# Altium project AWH6_V10.PrjPcb (part 2 of 2)

## Sheet Wi-Fi.SchDoc
size A3; SheetNumber: 4; SheetTotal: 10
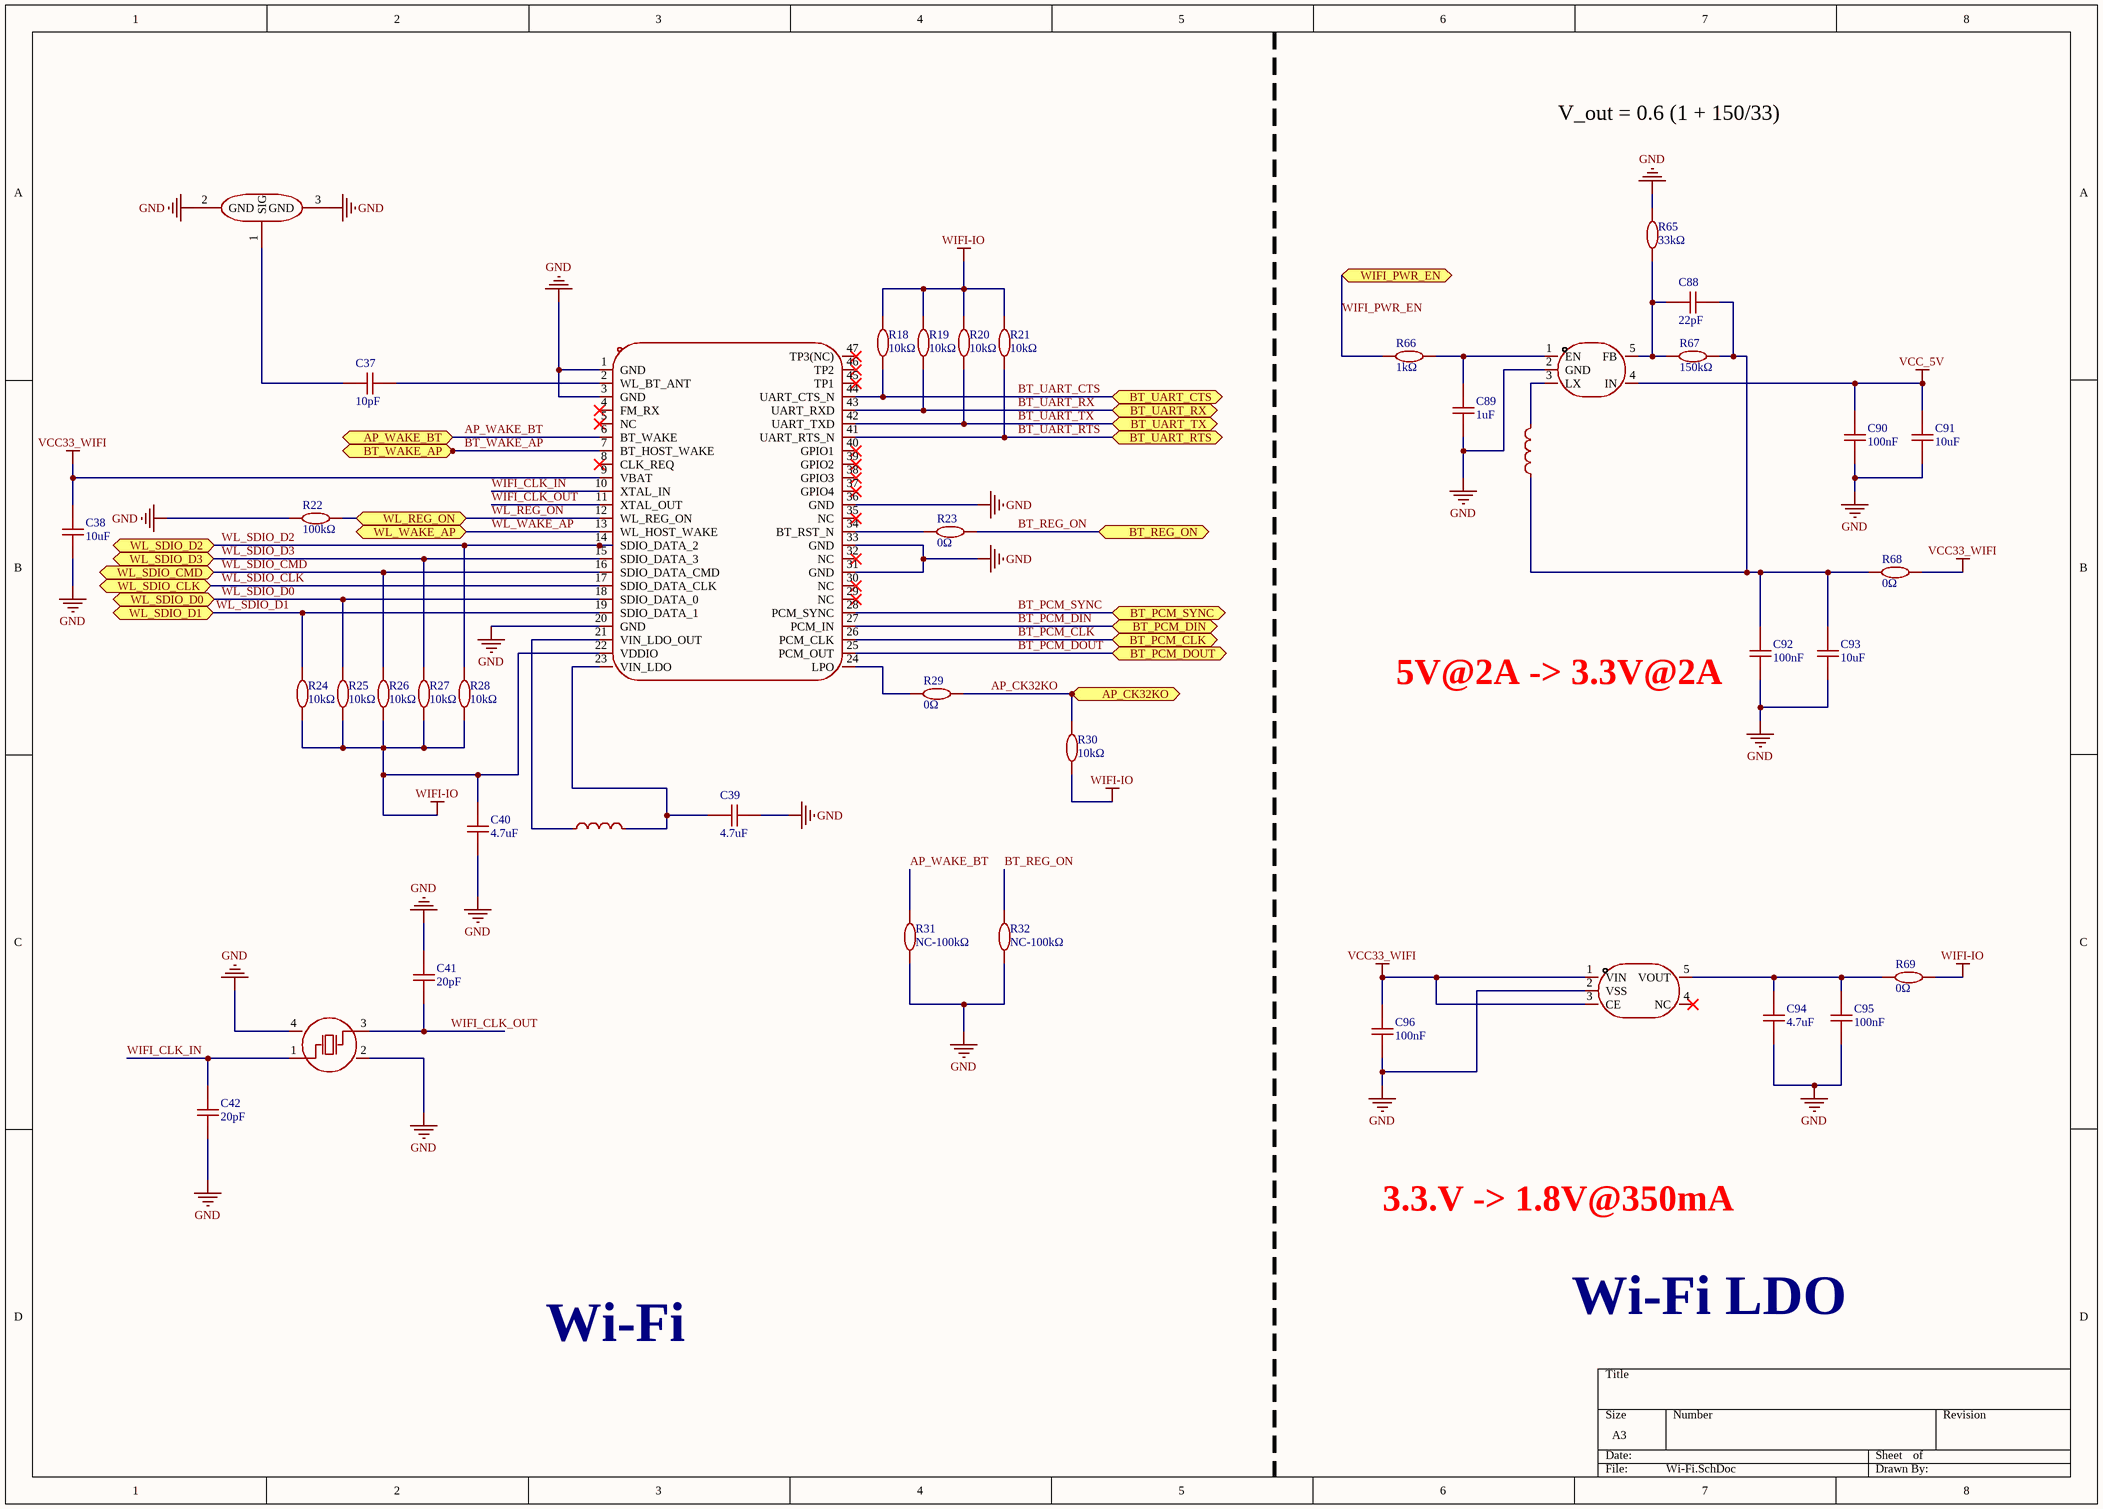
[diagram p5: Wi-Fi.SchDoc]

### Parts
C37  10pF  [C0402]
C38  10uF  [C0603]
C39  4.7uF  [C0402]
C40  4.7uF  [C0402]
C41  20pF  [C0402]
C42  20pF  [C0402]
C88  22pF  [C0402]
C89  1uF  [C0402]
C90  100nF  [C0402]
C91  10uF  [C0603]
C92  100nF  [C0402]
C93  10uF  [C0603]
C94  4.7uF  [C0402]
C95  100nF  [C0402]
C96  100nF  [C0402]
JP1  6GHz  [RF-SMD_FRF05002-JSS103M]  (value not drawn)
L1  4.7uH  [IND-SMD_L6.0-W6.0_FNR60XXS]  (value not drawn)
L7  4.7uH  [IND-SMD_L6.0-W6.0_FNR60XXS]  (value not drawn)
R18  10kΩ  [R0402]
R19  10kΩ  [R0402]
R20  10kΩ  [R0402]
R21  10kΩ  [R0402]
R22  100kΩ  [R0402]
R23  0Ω  [R0402]
R24  10kΩ  [R0402]
R25  10kΩ  [R0402]
R26  10kΩ  [R0402]
R27  10kΩ  [R0402]
R28  10kΩ  [R0402]
R29  0Ω  [R0402]
R30  10kΩ  [R0402]
R31  NC-100kΩ  [R0402]
R32  NC-100kΩ  [R0402]
R65  33kΩ  [R0402]
R66  1kΩ  [R0402]
R67  150kΩ  [R0402]
R68  0Ω  [R0402]
R69  0Ω  [R0402]
U6  2.4GHz  [QFN-44_L12.0-W12.0-P0.90-TL_AP6212]  (value not drawn)
U30  SY8089A1AAC  [TSOT-23-5_L2.9-W1.6-P0.95-LS2.8-BR]  (value not drawn)
U31  ME6212C18M5G  [SOT-23-5_L3.0-W1.7-P0.95-LS2.8-BL]  (value not drawn)
X1  26MHz  [CRYSTAL-SMD_4P-L3.2-W2.5-BL]  (value not drawn)

### Ports
AP_CK32KO (bidir, see SoC_2[4B]), AP_WAKE_BT (bidir, see SoC_1[6C]), BT_PCM_CLK (bidir, see SoC_1[6B]), BT_PCM_DIN (bidir, see SoC_1[6B]), BT_PCM_DOUT (bidir, see SoC_1[6B]), BT_PCM_SYNC (bidir, see SoC_1[6B]), BT_REG_ON (bidir, see SoC_1[6C]), BT_UART_CTS (bidir, see SoC_1[6B]), BT_UART_RTS (bidir, see SoC_1[6B]), BT_UART_RX (bidir, see SoC_1[6B]), BT_UART_TX (bidir, see SoC_1[6B]), BT_WAKE_AP (bidir, see SoC_1[6C]), WIFI_PWR_EN (bidir, see SoC_1[6B]), WL_REG_ON (bidir, see SoC_1[6C]), WL_SDIO_CLK (bidir, see SoC_1[7B]), WL_SDIO_CMD (bidir, see SoC_1[6B]), WL_SDIO_D0 (bidir, see SoC_1[6B]), WL_SDIO_D1 (bidir, see SoC_1[6B]), WL_SDIO_D2 (bidir, see SoC_1[6B]), WL_SDIO_D3 (bidir, see SoC_1[6B]), WL_WAKE_AP (bidir, see SoC_1[6C])

### Nets
GND: C38.1 C39.2 C40.1 C41.2 C42.1 C89.1 C90.1 C91.1 C92.1 C93.1 C94.1 C95.1 C96.1 JP1.2(GND) JP1.3(GND) R22.1 R31.1 R32.1 R65.2 U6.1(GND) U6.3(GND) U6.20(GND) U6.31(GND) U6.33(GND) U6.36(GND) U30.2(GND) U31.2(VSS) X1.2(GND) X1.4(GND)
VCC33_WIFI: C38.2 C96.2 R68.2 U6.9(VBAT) U31.1(VIN) U31.3(CE)
VCC_5V: C90.2 C91.2 U30.4(IN)  [project net PS]
WIFI-IO: C40.2 R18.2 R19.2 R20.2 R21.2 R24.1 R25.1 R26.1 R27.1 R28.1 R30.1 R69.2 U6.22(VDDIO)  [project net VCC_DCXOIO]
AP_CK32KO: R29.2 R30.2 ; port AP_CK32KO
AP_WAKE_BT: R31.2 U6.6(BT_WAKE) ; port AP_WAKE_BT
BT_PCM_CLK: U6.26(PCM_CLK) ; port BT_PCM_CLK
BT_PCM_DIN: U6.27(PCM_IN) ; port BT_PCM_DIN
BT_PCM_DOUT: U6.25(PCM_OUT) ; port BT_PCM_DOUT
BT_PCM_SYNC: U6.28(PCM_SYNC) ; port BT_PCM_SYNC
BT_REG_ON: R23.2 R32.2 ; port BT_REG_ON
BT_UART_CTS: R18.1 U6.44(UART_CTS_N) ; port BT_UART_CTS
BT_UART_RTS: R21.1 U6.41(UART_RTS_N) ; port BT_UART_RTS
BT_UART_RX: R19.1 U6.43(UART_RXD) ; port BT_UART_RX
BT_UART_TX: R20.1 U6.42(UART_TXD) ; port BT_UART_TX
BT_WAKE_AP: U6.7(BT_HOST_WAKE) ; port BT_WAKE_AP
WIFI_CLK_IN: C42.2 U6.10(XTAL_IN) X1.1(OSC1)
WIFI_CLK_OUT: C41.1 U6.11(XTAL_OUT) X1.3(OSC2)
WIFI_PWR_EN: R66.1 ; port WIFI_PWR_EN
WL_REG_ON: R22.2 U6.12(WL_REG_ON) ; port WL_REG_ON
WL_SDIO_CLK: U6.17(SDIO_DATA_CLK) ; port WL_SDIO_CLK
WL_SDIO_CMD: R26.2 U6.16(SDIO_DATA_CMD) ; port WL_SDIO_CMD
WL_SDIO_D0: R25.2 U6.18(SDIO_DATA_0) ; port WL_SDIO_D0
WL_SDIO_D1: R24.2 U6.19(SDIO_DATA_1) ; port WL_SDIO_D1
WL_SDIO_D2: R28.2 U6.14(SDIO_DATA_2) ; port WL_SDIO_D2
WL_SDIO_D3: R27.2 U6.15(SDIO_DATA_3) ; port WL_SDIO_D3
WL_WAKE_AP: U6.13(WL_HOST_WAKE) ; port WL_WAKE_AP
NetC37_1: C37.1 JP1.1(SIG)
NetC37_2: C37.2 U6.2(WL_BT_ANT)
NetC39_1: C39.1 L1.2 U6.23(VIN_LDO)
NetC88_1: C88.1 R65.1 R67.1 U30.5(FB)
NetC88_2: C88.2 C92.2 C93.2 L7.1 R67.2 R68.1
NetC89_2: C89.2 R66.2 U30.1(EN)
NetC94_2: C94.2 C95.2 R69.1 U31.5(VOUT)
NetL1_1: L1.1 U6.21(VIN_LDO_OUT)
NetL7_2: L7.2 U30.3(LX)
NetR23_1: R23.1 U6.34(BT_RST_N)
NetR29_1: R29.1 U6.24(LPO)

Not connected (* = marked no-connect by the designer): U6 4(FM_RX)* 5(NC)* 8(CLK_REQ)* 29(NC)* 30(NC)* 32(NC)* 35(NC)* 37(GPIO4)* 38(GPIO3)* 39(GPIO2)* 40(GPIO1)* 45(TP1)* 46(TP2)* 47(TP3(NC))*; U31 4(NC)*

### Notes on the sheet
- V_out = 0.6 (1 + 150/33)
- 5V@2A -> 3.3V@2A
- 3.3.V -> 1.8V@350mA
- Wi-Fi LDO
- Wi-Fi

### Library data of the parts
C37 = 10pF: 50V 10pF C0G ±5% 0402 Ceramic Capacitors ROHS
C38 C91 C93 = 10uF: 10V 10uF X5R ±10% 0603 Ceramic Capacitors ROHS
C39 C40 C94 = 4.7uF: 10V 4.7uF X5R ±20% 0402 Ceramic Capacitors ROHS
C41 C42 = 20pF: 50V 20pF NP0 ±5% 0402 Ceramic Capacitors ROHS
C88 = 22pF: 50V 22pF C0G ±5% 0402 Ceramic Capacitors ROHS
C89 = 1uF: 50V 1uF X5R ±10% 0402 Ceramic Capacitors ROHS
C90 C92 C95 C96 = 100nF: 50V 100nF X7R ±10% 0402 Ceramic Capacitors ROHS
JP1 = U.FL-R-SMT-1(80)_C88374: Manufacturer: HRS(广濑); Add into BOM: yes; Connector Type: Board Side; Interface: Male Pin; Number of Ports: 1; Interface Diameter: 2mm; Interface Length/Height: 1.25mm; RF Series: IPEX; Impedance: 50Ω; Symbol: U.FL-R-SMT-1(80); Device: U.FL-R-SMT-1(80)_C88374; LCSC Part Name: IPEX 内针; Supplier Part: C88374; Manufacturer Part: U.FL-R-SMT-1(80); Supplier Footprint: SMD; JLCPCB Part Class: Extended Part; Datasheet: https://item.szlcsc.com/datasheet/U.FL-R-SMT-1(80)/89553.html; Supplier: LCSC; Convert to PCB: yes; Value: 6GHz; Style: -; Operating Temperature Range: -40℃~+90℃
L1 L7 = FNR6020S4R7MT: 2.5A 4.7uH Magnetic Shielded Inductor ±20% 3.6A 75mΩ SMD,6x6mm Fixed Inductors ROHS; Manufacturer: cjiang(长江微电); Add into BOM: yes; Symbol: FNR6020S4R7MT; Device: FNR6020S4R7MT; LCSC Part Name: 4.7uH ±20% 3.6A; Supplier Part: C168008; Manufacturer Part: FNR6020S4R7MT; Supplier Footprint: SMD,6x6mm; JLCPCB Part Class: Extended Part; Datasheet: https://atta.szlcsc.com/upload/public/pdf/source/20190327/C167925_9EFF0AABC4CA629C2CC95961DBF7D39D.pdf; Supplier: LCSC; Convert to PCB: yes; Value: 4.7uH; Tolerance: ±20%; Saturation Current (Isat): 3.6A; DC Resistance (DCR): 75mΩ
R18-R21 R24-R28 R30 = 10kΩ: 62.5mW 10kΩ 50V ±100ppm/℃ Thick Film Resistor ±1% 0402 Chip Resistor - Surface Mount ROHS
R22 R31 R32 = 100kΩ: 100kΩ 62.5mW 50V ±100ppm/℃ Thick Film Resistor ±1% 0402 Chip Resistor - Surface Mount ROHS
R23 R29 R68 R69 = 0Ω: 0Ω 62.5mW 50V Thick Film Resistor ±1% 0402 Chip Resistor - Surface Mount ROHS
R65 = 33kΩ: 62.5mW 33kΩ 50V ±100ppm/℃ Thick Film Resistor ±1% 0402 Chip Resistor - Surface Mount ROHS
R66 = 1kΩ: 1kΩ 62.5mW 50V ±100ppm/℃ Thick Film Resistor ±1% 0402 Chip Resistor - Surface Mount ROHS
R67 = 150kΩ: 62.5mW 150kΩ 50V ±100ppm/℃ Thick Film Resistor ±1% 0402 Chip Resistor - Surface Mount ROHS
U6 = AP6212: 2.4GHz -90dBm QFN-44(12x12) RF Transceiver Modules and Modems ROHS; Manufacturer: AMPAK(正基科技); Add into BOM: yes; Interface Type: On-board PCB antenna; Output Power: 16dBm; Symbol: AP6212; Device: AP6212; LCSC Part Name: AP6212; Supplier Part: C2798300; Manufacturer Part: AP6212; Supplier Footprint: QFN-44(12x12); JLCPCB Part Class: Extended Part; Datasheet: https://item.szlcsc.com/datasheet/AP6212/2941698.html; Supplier: LCSC; Convert to PCB: yes; Utilized IC / Part: -; Wireless Standard: -; Value: 2.4GHz; Antenna Type: -; Voltage - Supply: -; Receive  Current: -; Send  Current: -; Sensitivity: -90dBm; Operating Temperature: -30℃~+85℃
U30 = SY8089A1AAC: 1.5MHz Buck 2A Adjustable 1 SOT-23-5 Voltage Regulators - DC DC Switching Regulators ROHS; Manufacturer: Silergy(矽力杰); Add into BOM: yes; Voltage - Supply: 2.5V~5.5V; Number of Outputs: 1; Quiescent Current: 50uA; Switch tube (built-in/external): Built-In; Symbol: SY8089A1AAC; Device: SY8089A1AAC; LCSC Part Name: 高效1.5MHz 2A同步降压调节器; Supplier Part: C479074; Manufacturer Part: SY8089A1AAC; Supplier Footprint: SOT-23-5; JLCPCB Part Class: Extended Part; Datasheet: https://item.szlcsc.com/datasheet/SY8089A1AAC/486366.html; Supplier: LCSC; Convert to PCB: yes; Function: Buck; Output Voltage: -; Output Current: 2A; Frequency - Switching: 1.5MHz; Operating Temperature: -40℃~+125℃@(TA/TJ); Synchronous Rectifier: Yes; Topology: Buck; Output Type: Adjustable
U31 = ME6212C18M5G: 65dB@(1kHz) Positive Fixed 1.8V SOT-23-5 Voltage Regulators - Linear, Low Drop Out (LDO) Regulators ROHS; Manufacturer: MICRONE(南京微盟); Add into BOM: yes; Voltage - Supply: 6V; Output Current: 350mA; Voltage Dropout: 200mV@(100mA); standby current: 50uA; Noise: 50uVrms; Number of Outputs: 1; Symbol: ME6212C18M5G; Device: ME6212C18M5G; LCSC Part Name: 输入6V 输出1.8V 250mA; Supplier Part: C236669; Manufacturer Part: ME6212C18M5G; Supplier Footprint: SOT-23-5; JLCPCB Part Class: Extended Part; Datasheet: https://item.szlcsc.com/datasheet/ME6212C18M5G/236109.html; Supplier: LCSC; Convert to PCB: yes; Output Type: Fixed; Output Voltage: 1.8V; Power Supply Rejection Ratio (PSRR): 65dB@(1kHz); Features: Enable; Operating Temperature: -40℃~+150℃@(Ta); Output Configuration: Positive
X1 = TAXM26M4RLBCCT2T: Crystal Oscillator 20pF SMD3225-4P Crystals ROHS; Manufacturer: YJX(雅晶鑫); Symbol: SMD-3225_4P26MHZ20PF10PPM-40~+85℃; Add into BOM: yes; Normal temperature Frequency Tolerance: ±10ppm; Frequency Stability: ±50ppm; Equivalent Series Resistance(ESR): 80Ω; Device: TAXM26M4RLBCCT2T; LCSC Part Name: 26MHz ±10ppm 20pF; Supplier Part: C164050; Manufacturer Part: TAXM26M4RLBCCT2T; Supplier Footprint: SMD3225-4P; JLCPCB Part Class: Extended Part; Datasheet: https://item.szlcsc.com/datasheet/TAXM26M4RLBCCT2T/175432.html; Supplier: LCSC; Convert to PCB: yes; Type: Crystal Oscillator; Value: 26MHz; Load Capacitance: 20pF; Operating Temperature: -40℃~+85℃

## Sheet SoC_2.SchDoc
size A3; SheetNumber: 6; SheetTotal: 10
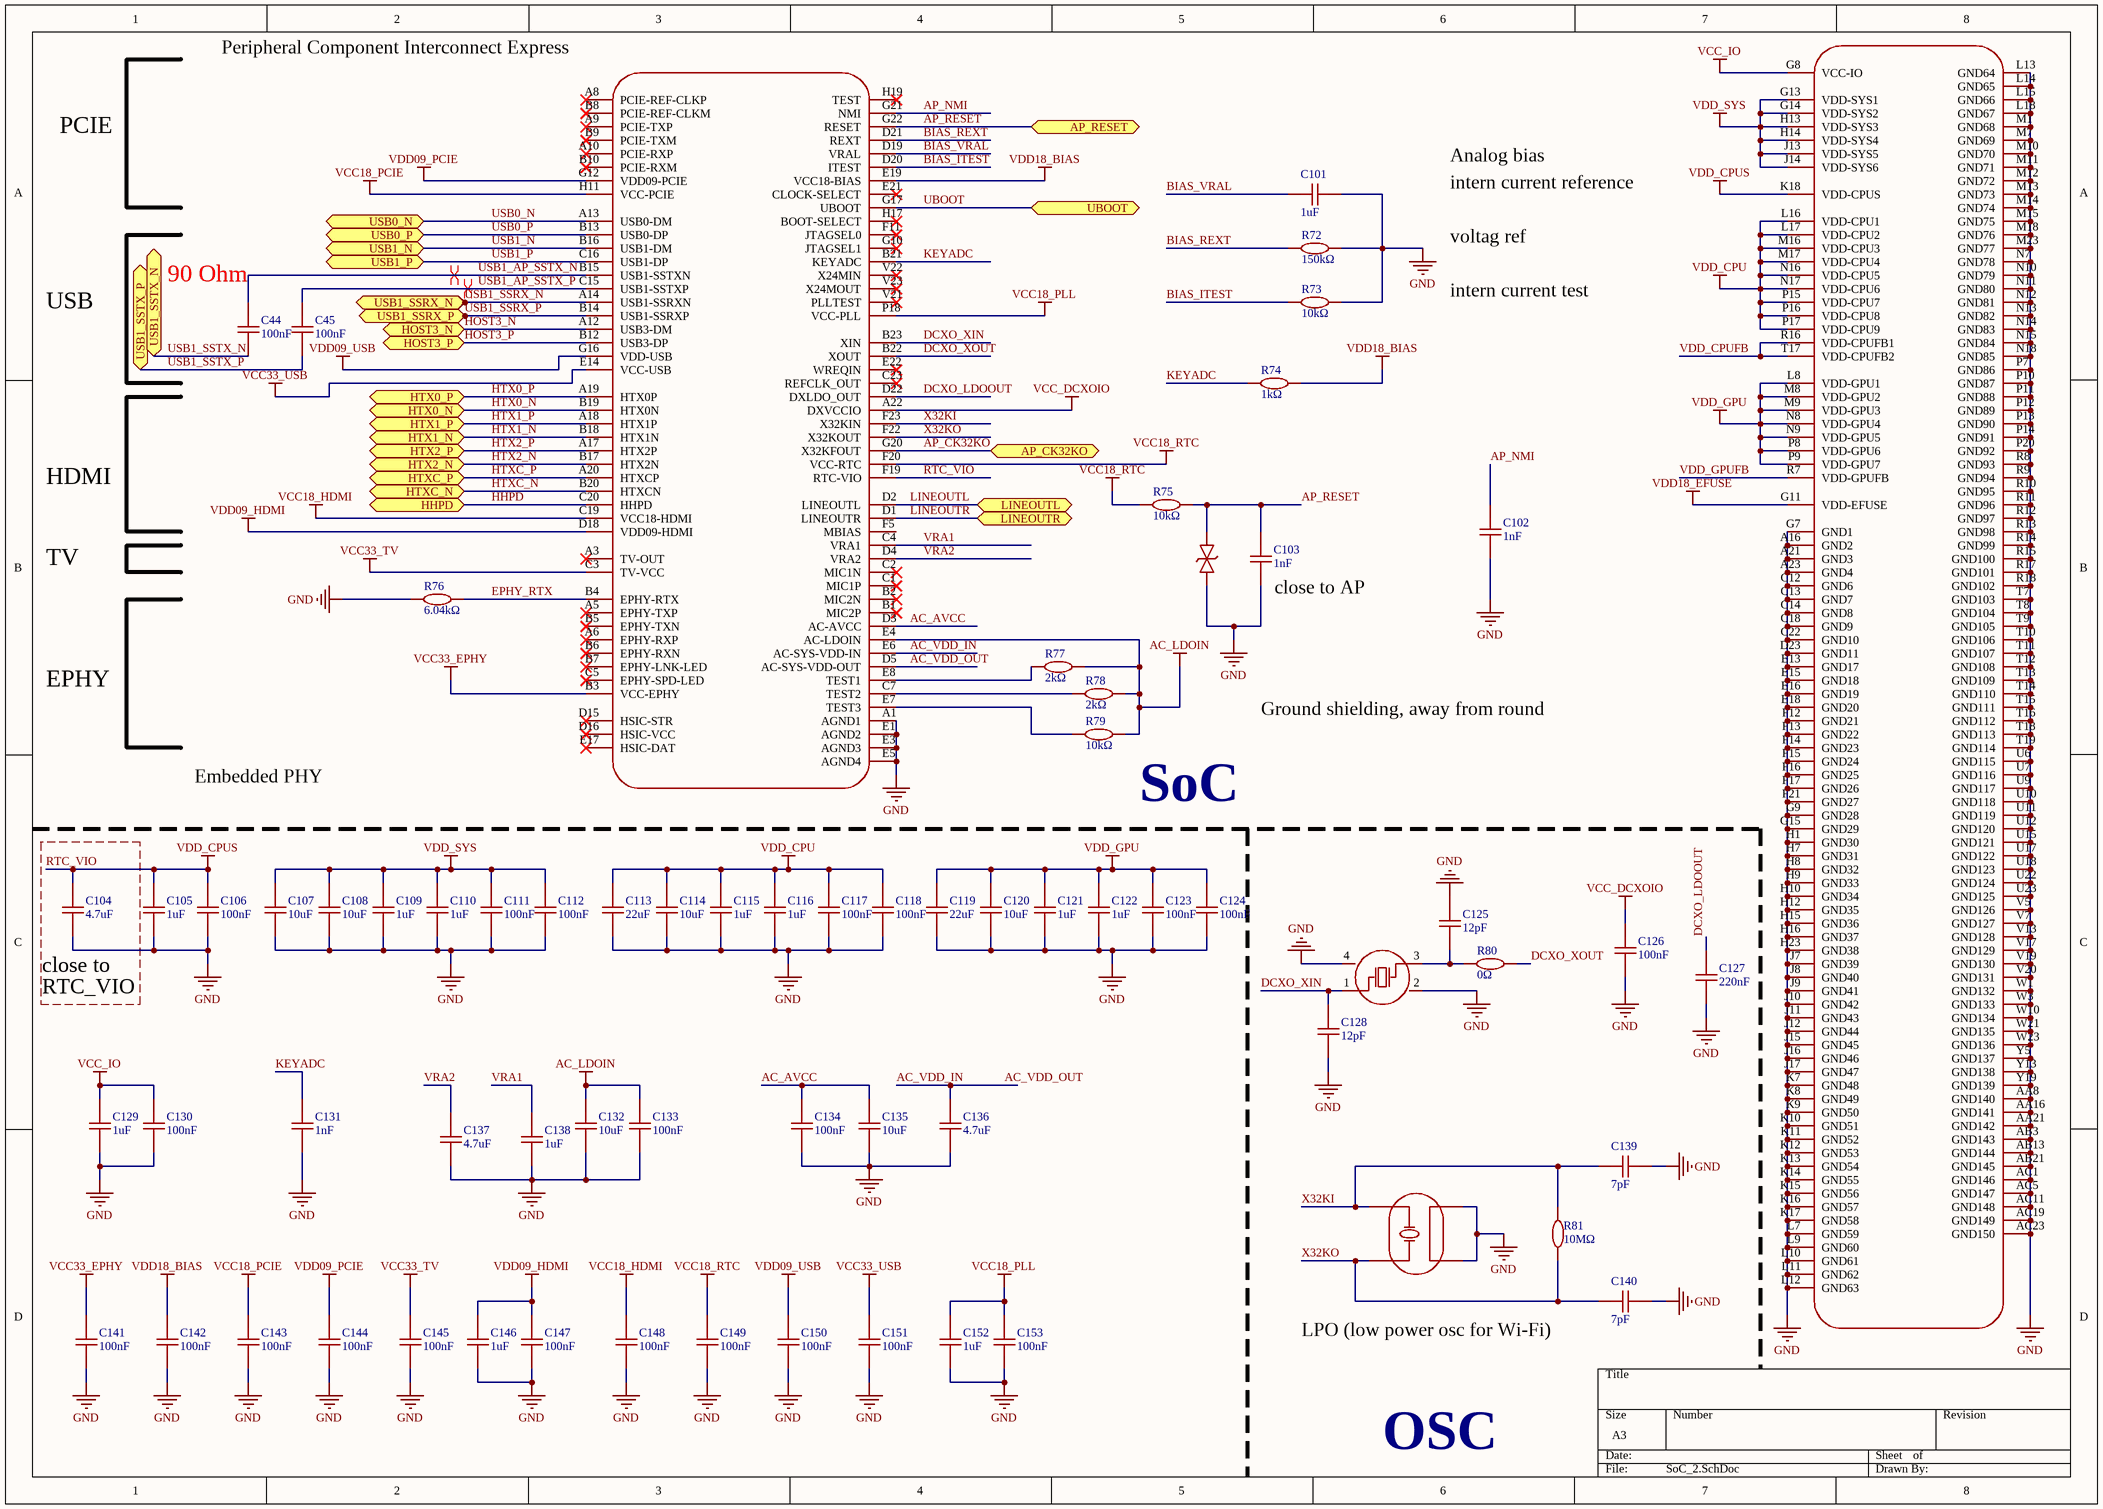
[diagram p6: SoC_2.SchDoc]

### Parts
C44  100nF  [C0402]
C45  100nF  [C0402]
C101  1uF  [C0402]
C102  1nF  [C0402]
C103  1nF  [C0402]
C104  4.7uF  [C0402]
C105  1uF  [C0402]
C106  100nF  [C0402]
C107  10uF  [C0603]
C108  10uF  [C0603]
C109  1uF  [C0402]
C110  1uF  [C0402]
C111  100nF  [C0402]
C112  100nF  [C0402]
C113  22uF  [C0603]
C114  10uF  [C0603]
C115  1uF  [C0402]
C116  1uF  [C0402]
C117  100nF  [C0402]
C118  100nF  [C0402]
C119  22uF  [C0603]
C120  10uF  [C0603]
C121  1uF  [C0402]
C122  1uF  [C0402]
C123  100nF  [C0402]
C124  100nF  [C0402]
C125  12pF  [C0402]
C126  100nF  [C0402]
C127  220nF  [C0402]
C128  12pF  [C0402]
C129  1uF  [C0402]
C130  100nF  [C0402]
C131  1nF  [C0402]
C132  10uF  [C0603]
C133  100nF  [C0402]
C134  100nF  [C0402]
C135  10uF  [C0603]
C136  4.7uF  [C0402]
C137  4.7uF  [C0402]
C138  1uF  [C0402]
C139  7pF  [C0402]
C140  7pF  [C0402]
C141  100nF  [C0402]
C142  100nF  [C0402]
C143  100nF  [C0402]
C144  100nF  [C0402]
C145  100nF  [C0402]
C146  1uF  [C0402]
C147  100nF  [C0402]
C148  100nF  [C0402]
C149  100nF  [C0402]
C150  100nF  [C0402]
C151  100nF  [C0402]
C152  1uF  [C0402]
C153  100nF  [C0402]
R72  150kΩ  [R0402]
R73  10kΩ  [R0402]
R74  1kΩ  [R0402]
R75  10kΩ  [R0402]
R76  6.04kΩ  [R0402]
R77  2kΩ  [R0402]
R78  2kΩ  [R0402]
R79  10kΩ  [R0402]
R80  0Ω  [R0402]
R81  10MΩ  [R0402]
U2  Allwinner_H6  [BGA451_ALLWINNER_H6]  (value not drawn)  (parts C,D of 4)
U32  ESD5451N  [DFN1006-2L-BI]  (value not drawn)
X2  24MHz  [CRYSTAL-SMD_4P-L3.2-W2.5-BL]  (value not drawn)
X3  32.768kHz  [MC-146_4P-L6.7-W1.5-P0.85-TL]  (value not drawn)

### Ports
AP_CK32KO (bidir, see Wi-Fi[5B]), AP_RESET (bidir, see GPIO[6C], Power[4B]), HHPD (bidir, see Audio-HDMI[4C]), HOST3_N (bidir, see TF-USB[3C]), HOST3_P (bidir, see TF-USB[3C]), HTX0_N (bidir, see Audio-HDMI[4C]), HTX0_P (bidir, see Audio-HDMI[4C]), HTX1_N (bidir, see Audio-HDMI[4C]), HTX1_P (bidir, see Audio-HDMI[4B]), HTX2_N (bidir, see Audio-HDMI[4B]), HTX2_P (bidir, see Audio-HDMI[4B]), HTXC_N (bidir, see Audio-HDMI[4C]), HTXC_P (bidir, see Audio-HDMI[4C]), LINEOUTL (bidir, see Audio-HDMI[6A]), LINEOUTR (bidir, see Audio-HDMI[6A]), UBOOT (bidir, see GPIO[6C]), USB0_N (bidir, see TF-USB[8A]), USB0_P (bidir, see TF-USB[8A]), USB1_N (bidir, see TF-USB[5C]), USB1_P (bidir, see TF-USB[5C]), USB1_SSRX_N (bidir, see SoC_2[2A], TF-USB[6C]), USB1_SSRX_P (bidir, see TF-USB[6C]), USB1_SSTX_N (bidir, see TF-USB[6C]), USB1_SSTX_P (bidir, see TF-USB[6C])

### Nets
AC_LDOIN: C132.2 C133.2 C141.2 C145.2 R77.2 R78.2 R79.1 U2.B3(VCC-EPHY) U2.C3(TV-VCC) U2.E4(AC-LDOIN)  [also labelled VCC33_EPHY, VCC33_TV]  [project net ALDO2]
GND: C101.2 C102.1 C103.1 C104.1 C105.1 C106.1 C107.1 C108.1 C109.1 C110.1 C111.1 C112.1 C113.1 C114.1 C115.1 C116.1 C117.1 C118.1 C119.1 C120.1 C121.1 C122.1 C123.1 C124.1 C125.2 C126.1 C127.1 C128.1 C129.1 C130.1 C131.1 C132.1 C133.1 C134.1 C135.1 C136.1 C137.1 C138.1 C139.2 C140.2 C141.1 C142.1 C143.1 C144.1 C145.1 C146.1 C147.1 C148.1 C149.1 C150.1 C151.1 C152.1 C153.1 R72.2 R73.2 R76.1 U2.A1(AGND1) U2.A16(GND2) U2.A21(GND3) U2.A23(GND4) U2.AA8(GND140) U2.AA16(GND141) U2.AA21(GND142) U2.AB3(GND143) U2.AB13(GND144) U2.AB21(GND145) U2.AC1(GND146) U2.AC5(GND147) U2.AC11(GND148) U2.AC19(GND149) U2.AC23(GND150) U2.C12(GND6) U2.C13(GND7) U2.C14(GND8) U2.C18(GND9) U2.C22(GND10) U2.D23(GND11) U2.E1(AGND2) U2.E3(AGND3) U2.E5(AGND4) U2.E13(GND17) U2.E15(GND18) U2.E16(GND19) U2.E18(GND20) U2.F12(GND21) U2.F13(GND22) U2.F14(GND23) U2.F15(GND24) U2.F16(GND25) U2.F17(GND26) U2.F21(GND27) U2.G7(GND1) U2.G9(GND28) U2.G15(GND29) U2.H1(GND30) U2.H7(GND31) U2.H8(GND32) U2.H9(GND33) U2.H10(GND34) U2.H12(GND35) U2.H15(GND36) U2.H16(GND37) U2.H23(GND38) U2.J7(GND39) U2.J8(GND40) U2.J9(GND41) U2.J10(GND42) U2.J11(GND43) U2.J12(GND44) U2.J15(GND45) U2.J16(GND46) U2.J17(GND47) U2.K7(GND48) U2.K8(GND49) U2.K9(GND50) U2.K10(GND51) U2.K11(GND52) U2.K12(GND53) U2.K13(GND54) U2.K14(GND55) U2.K15(GND56) U2.K16(GND57) U2.K17(GND58) U2.L7(GND59) U2.L9(GND60) U2.L10(GND61) U2.L11(GND62) U2.L12(GND63) U2.L13(GND64) U2.L14(GND65) U2.L15(GND66) U2.L18(GND67) U2.M1(GND68) U2.M7(GND69) U2.M10(GND70) U2.M11(GND71) U2.M12(GND72) U2.M13(GND73) U2.M14(GND74) U2.M15(GND75) U2.M18(GND76) U2.M23(GND77) U2.N7(GND78) U2.N10(GND79) U2.N11(GND80) U2.N12(GND81) U2.N13(GND82) U2.N14(GND83) U2.N15(GND84) U2.N18(GND85) U2.P7(GND86) U2.P10(GND87) U2.P11(GND88) U2.P12(GND89) U2.P13(GND90) U2.P14(GND91) U2.P20(GND92) U2.R8(GND93) U2.R9(GND94) U2.R10(GND95) U2.R11(GND96) U2.R12(GND97) U2.R13(GND98) U2.R14(GND99) U2.R15(GND100) U2.R17(GND101) U2.R18(GND102) U2.T7(GND103) U2.T8(GND104) U2.T9(GND105) U2.T10(GND106) U2.T11(GND107) U2.T12(GND108) U2.T13(GND109) U2.T14(GND110) U2.T15(GND111) U2.T16(GND112) U2.T18(GND113) U2.T19(GND114) U2.U6(GND115) U2.U7(GND116) U2.U9(GND117) U2.U10(GND118) U2.U11(GND119) U2.U12(GND120) U2.U15(GND121) U2.U17(GND122) U2.U18(GND123) U2.U22(GND124) U2.U23(GND125) U2.V5(GND126) U2.V7(GND127) U2.V13(GND128) U2.V17(GND129) U2.V19(GND130) U2.V20(GND131) U2.W1(GND132) U2.W3(GND133) U2.W10(GND134) U2.W21(GND135) U2.W23(GND136) U2.Y5(GND137) U2.Y13(GND138) U2.Y19(GND139) U32.1 X2.2(GND) X2.4(GND) X3.2 X3.3
RTC_VIO: C104.2 C105.2 C106.2 U2.F19(RTC-VIO) U2.K18(VDD-CPUS)  [also labelled VDD_CPUS]
VCC18_HDMI: C143.2 C148.2 U2.C19(VCC18-HDMI) U2.G11(VDD-EFUSE) U2.H11(VCC-PCIE)  [also labelled VCC18_PCIE, VDD18_EFUSE]  [project net BLDO2]
VCC18_PLL: C142.2 C152.2 C153.2 R74.2 U2.E19(VCC18-BIAS) U2.P18(VCC-PLL)  [also labelled VDD18_BIAS]  [project net BLDO1]
VCC18_RTC: C149.2 R75.1 U2.F20(VCC-RTC)
VCC33_USB: C129.2 C130.2 C151.2 U2.E14(VCC-USB) U2.G8(VCC-IO)  [also labelled VCC_IO]  [project net ALDO3]
VCC_DCXOIO: C126.2 U2.A22(DXVCCIO)
VDD09_HDMI: C107.2 C108.2 C109.2 C110.2 C111.2 C112.2 C144.2 C146.2 C147.2 C150.2 U2.D18(VDD09-HDMI) U2.G12(VDD09-PCIE) U2.G13(VDD-SYS1) U2.G14(VDD-SYS2) U2.G16(VDD-USB) U2.H13(VDD-SYS3) U2.H14(VDD-SYS4) U2.J13(VDD-SYS5) U2.J14(VDD-SYS6)  [also labelled VDD09_PCIE, VDD09_USB, VDD_SYS]
VDD_CPU: C113.2 C114.2 C115.2 C116.2 C117.2 C118.2 U2.L16(VDD-CPU1) U2.L17(VDD-CPU2) U2.M16(VDD-CPU3) U2.M17(VDD-CPU4) U2.N16(VDD-CPU5) U2.N17(VDD-CPU6) U2.P15(VDD-CPU7) U2.P16(VDD-CPU8) U2.P17(VDD-CPU9)
VDD_GPU: C119.2 C120.2 C121.2 C122.2 C123.2 C124.2 U2.L8(VDD-GPU1) U2.M8(VDD-GPU2) U2.M9(VDD-GPU3) U2.N8(VDD-GPU4) U2.N9(VDD-GPU5) U2.P8(VDD-GPU6) U2.P9(VDD-GPU7)
AC_AVCC: C134.2 C135.2 U2.D3(AC-AVCC)
AC_VDD_IN: C136.2 U2.D5(AC-SYS-VDD-OUT) U2.E6(AC-SYS-VDD-IN)  [also labelled AC_VDD_OUT]
AP_CK32KO: U2.G20(X32KFOUT) ; port AP_CK32KO
AP_NMI: C102.2 U2.G21(NMI)
AP_RESET: C103.2 R75.2 U2.G22(RESET) U32.2 ; port AP_RESET
BIAS_ITEST: R73.1 U2.D20(ITEST)
BIAS_REXT: R72.1 U2.D21(REXT)
BIAS_VRAL: C101.1 U2.D19(VRAL)
DCXO_LDOOUT: C127.2 U2.D22(DXLDO_OUT)
DCXO_XIN: C128.2 U2.B23(XIN) X2.1(OSC1)
DCXO_XOUT: R80.2 U2.B22(XOUT)
EPHY_RTX: R76.2 U2.B4(EPHY-RTX)
HHPD: U2.C20(HHPD) ; port HHPD
HOST3_N: U2.A12(USB3-DM) ; port HOST3_N
HOST3_P: U2.B12(USB3-DP) ; port HOST3_P
HTX0_N: U2.B19(HTX0N) ; port HTX0_N
HTX0_P: U2.A19(HTX0P) ; port HTX0_P
HTX1_N: U2.B18(HTX1N) ; port HTX1_N
HTX1_P: U2.A18(HTX1P) ; port HTX1_P
HTX2_N: U2.B17(HTX2N) ; port HTX2_N
HTX2_P: U2.A17(HTX2P) ; port HTX2_P
HTXC_N: U2.B20(HTXCN) ; port HTXC_N
HTXC_P: U2.A20(HTXCP) ; port HTXC_P
KEYADC: C131.2 R74.1 U2.B21(KEYADC)
LINEOUTL: U2.D2(LINEOUTL) ; port LINEOUTL
LINEOUTR: U2.D1(LINEOUTR) ; port LINEOUTR
UBOOT: U2.G17(UBOOT) ; port UBOOT
USB0_N: U2.A13(USB0-DM) ; port USB0_N
USB0_P: U2.B13(USB0-DP) ; port USB0_P
USB1_AP_SSTX_N: C44.2 U2.B15(USB1-SSTXN)
USB1_AP_SSTX_P: C45.2 U2.C15(USB1-SSTXP)
USB1_N: U2.B16(USB1-DM) ; port USB1_N
USB1_P: U2.C16(USB1-DP) ; port USB1_P
USB1_SSRX_N: U2.A14(USB1-SSRXN) ; port USB1_SSRX_N
USB1_SSRX_P: U2.B14(USB1-SSRXP) ; port USB1_SSRX_P
USB1_SSTX_N: C44.1 ; port USB1_SSTX_N
USB1_SSTX_P: C45.1 ; port USB1_SSTX_P
VDD_CPUFB: U2.R16(VDD-CPUFB1) U2.T17(VDD-CPUFB2)
VDD_GPUFB: U2.R7(VDD-GPUFB)
VRA1: C138.2 U2.C4(VRA1)
VRA2: C137.2 U2.D4(VRA2)
X32KI: C139.1 R81.2 U2.F23(X32KIN) X3.4(OSC2)
X32KO: C140.1 R81.1 U2.F22(X32KOUT) X3.1(OSC1)
NetC125_1: C125.1 R80.1 X2.3(OSC2)
NetR77_1: R77.1 U2.E8(TEST1)
NetR78_1: R78.1 U2.C7(TEST2)
NetR79_2: R79.2 U2.E7(TEST3)

Not connected (* = marked no-connect by the designer): U2 A3(TV-OUT)* A5(EPHY-TXP)* A6(EPHY-RXP)* A8(PCIE-REF-CLKP)* A9(PCIE-TXP)* A10(PCIE-RXP)* B1(MIC2P)* B2(MIC2N)* B5(EPHY-TXN)* B6(EPHY-RXN)* B7(EPHY-LNK-LED)* B8(PCIE-REF-CLKM)* B9(PCIE-TXM)* B10(PCIE-RXM)* C1(MIC1P)* C2(MIC1N)* C5(EPHY-SPD-LED)* C23(REFCLK_OUT)* D15(HSIC-STR)* D16(HSIC-VCC)* E17(HSIC-DAT)* E21(CLOCK-SELECT)* E22(WREQIN)* F5(MBIAS) F11(JTAGSEL0)* G10(JTAGSEL1)* H17(BOOT-SELECT)* H19(TEST)* V21(PLLTEST)* V22(X24MIN)* V23(X24MOUT)*

### Layout directives
differential pair: USB1_AP_SSTX_N, USB1_AP_SSTX_P

### Notes on the sheet
- (near U2) Peripheral Component Interconnect Express
- PCIE
- Analog bias
- intern current reference
- voltag ref
- USB
- (near C44) 90 Ohm
- intern current test
- HDMI
- TV
- (near C103) close to AP
- EPHY
- Ground shielding, away from round
- Embedded PHY
- (near R79) SoC
- close to
- RTC_VIO
- (near C140) LPO (low power osc for Wi-Fi)
- OSC

### Library data of the parts
C44 C45 C106 C111 C112 C117 C118 C123 C124 C126 C130 C133 C134 C141-C145 C147-C151 C153 = 100nF: as C90 on sheet Wi-Fi
C101 C105 C109 C110 C115 C116 C121 C122 C129 C138 C146 C152 = 1uF: as C89 on sheet Wi-Fi
C102 C103 C131 = 1nF: 50V 1nF X7R ±10% 0402 Ceramic Capacitors ROHS
C104 C136 C137 = 4.7uF: as C39 on sheet Wi-Fi
C107 C108 C114 C120 C132 C135 = 10uF: as C38 on sheet Wi-Fi
C113 C119 = 22uF: 16V 22uF X5R ±20% 0603 Ceramic Capacitors ROHS
C125 C128 = 12pF: 50V 12pF C0G ±5% 0402 Ceramic Capacitors ROHS
C127 = 220nF: 16V 220nF X7R ±10% 0402 Ceramic Capacitors ROHS
C139 C140 = 7pF: 50V 7pF NP0 0402 Ceramic Capacitors ROHS
R72 = 150kΩ: as R67 on sheet Wi-Fi
R73 R75 R79 = 10kΩ: as R18-R21 on sheet Wi-Fi
R74 = 1kΩ: as R66 on sheet Wi-Fi
R76 = 6.04kΩ: 6.04kΩ 62.5mW 50V ±100ppm/℃ Thick Film Resistor ±1% 0402 Chip Resistor - Surface Mount ROHS
R77 R78 = 2kΩ: 100mW 2kΩ 75V ±100ppm/℃ Thick Film Resistor ±1% 0402 Chip Resistor - Surface Mount ROHS
R80 = 0Ω: as R23 on sheet Wi-Fi
R81 = 10MΩ: 62.5mW 10MΩ 50V ±100ppm/℃ Thick Film Resistor ±1% 0402 Chip Resistor - Surface Mount ROHS
U2 = Allwinner_H6: Add into BOM: yes; Symbol: Allwinner_H6; Device: Allwinner_H6; Convert to PCB: yes
U32 = ESD5451N_C5261080: 9A 9.8V 8V Bidirectional 5V DFN1006-2L TVS Diodes ROHS; Manufacturer: HXY MOSFET(华轩阳电子); Add into BOM: yes; Reverse Leakage Current (Ir): 500nA; Number of Channels: 1.0; level of protection: IEC 61000-4-2; Junction Capacitance: 15pF; Symbol: ESD5451N_C5261080; Device: ESD5451N_C5261080; LCSC Part Name: 5V 15pF 双向; Supplier Part: C5261080; Manufacturer Part: ESD5451N; Supplier Footprint: DFN1006-2L; JLCPCB Part Class: Extended Part; Datasheet: https://item.szlcsc.com/datasheet/ESD5451N/5983779.html; Supplier: LCSC; Convert to PCB: yes; Polarity: Bidirectional; Reverse Stand-Off Voltage (Vrwm): 5V; Clamping Voltage: 9.8V; Peak Pulse Current (Ipp): 9A; Voltage - Breakdown: 8V; Type: ESD
X2 = X322524MOB4SI: Crystal Oscillator 12pF SMD3225-4P Crystals ROHS; Manufacturer: YXC(扬兴晶振); Add into BOM: yes; Normal temperature Frequency Tolerance: ±10ppm; Frequency Stability: ±20ppm; Symbol: X322524MOB4SI; Device: X322524MOB4SI; LCSC Part Name: YSX321SL 24MHZ 4P 3225 12PF ±10PPM -40~85℃ (±20PPM); Supplier Part: C70590; Manufacturer Part: X322524MOB4SI; Supplier Footprint: SMD3225-4P; JLCPCB Part Class: Extended Part; Datasheet: https://item.szlcsc.com/datasheet/X322524MOB4SI/71688.html; Supplier: LCSC; Convert to PCB: yes; Type: Surface Mount Crystal; Value: 24MHz; Load Capacitance: 12pF; Operating Temperature: -40℃~+85℃
X3 = Q13MC14610001: Crystal Oscillator 7pF MC-146 Crystals ROHS; Manufacturer: EPSON(爱普生); Symbol: MC-14632.768kHz7.0pF20PPM; Add into BOM: yes; Normal temperature Frequency Tolerance: ±20ppm; Equivalent Series Resistance(ESR): 65kΩ; Device: Q13MC14610001; LCSC Part Name: 32.768kHz ±20ppm 7pF; Supplier Part: C94977; Manufacturer Part: Q13MC14610001; Supplier Footprint: MC-146; JLCPCB Part Class: Extended Part; Datasheet: https://atta.szlcsc.com/upload/public/pdf/source/20170211/1486785670215.pdf; Supplier: LCSC; Convert to PCB: yes; Type: Surface Mount Crystal; Value: 32.768kHz; Operating Temperature: -40℃~+85℃

## Sheet GPIO.SchDoc
size A3; SheetNumber: 10; SheetTotal: 10
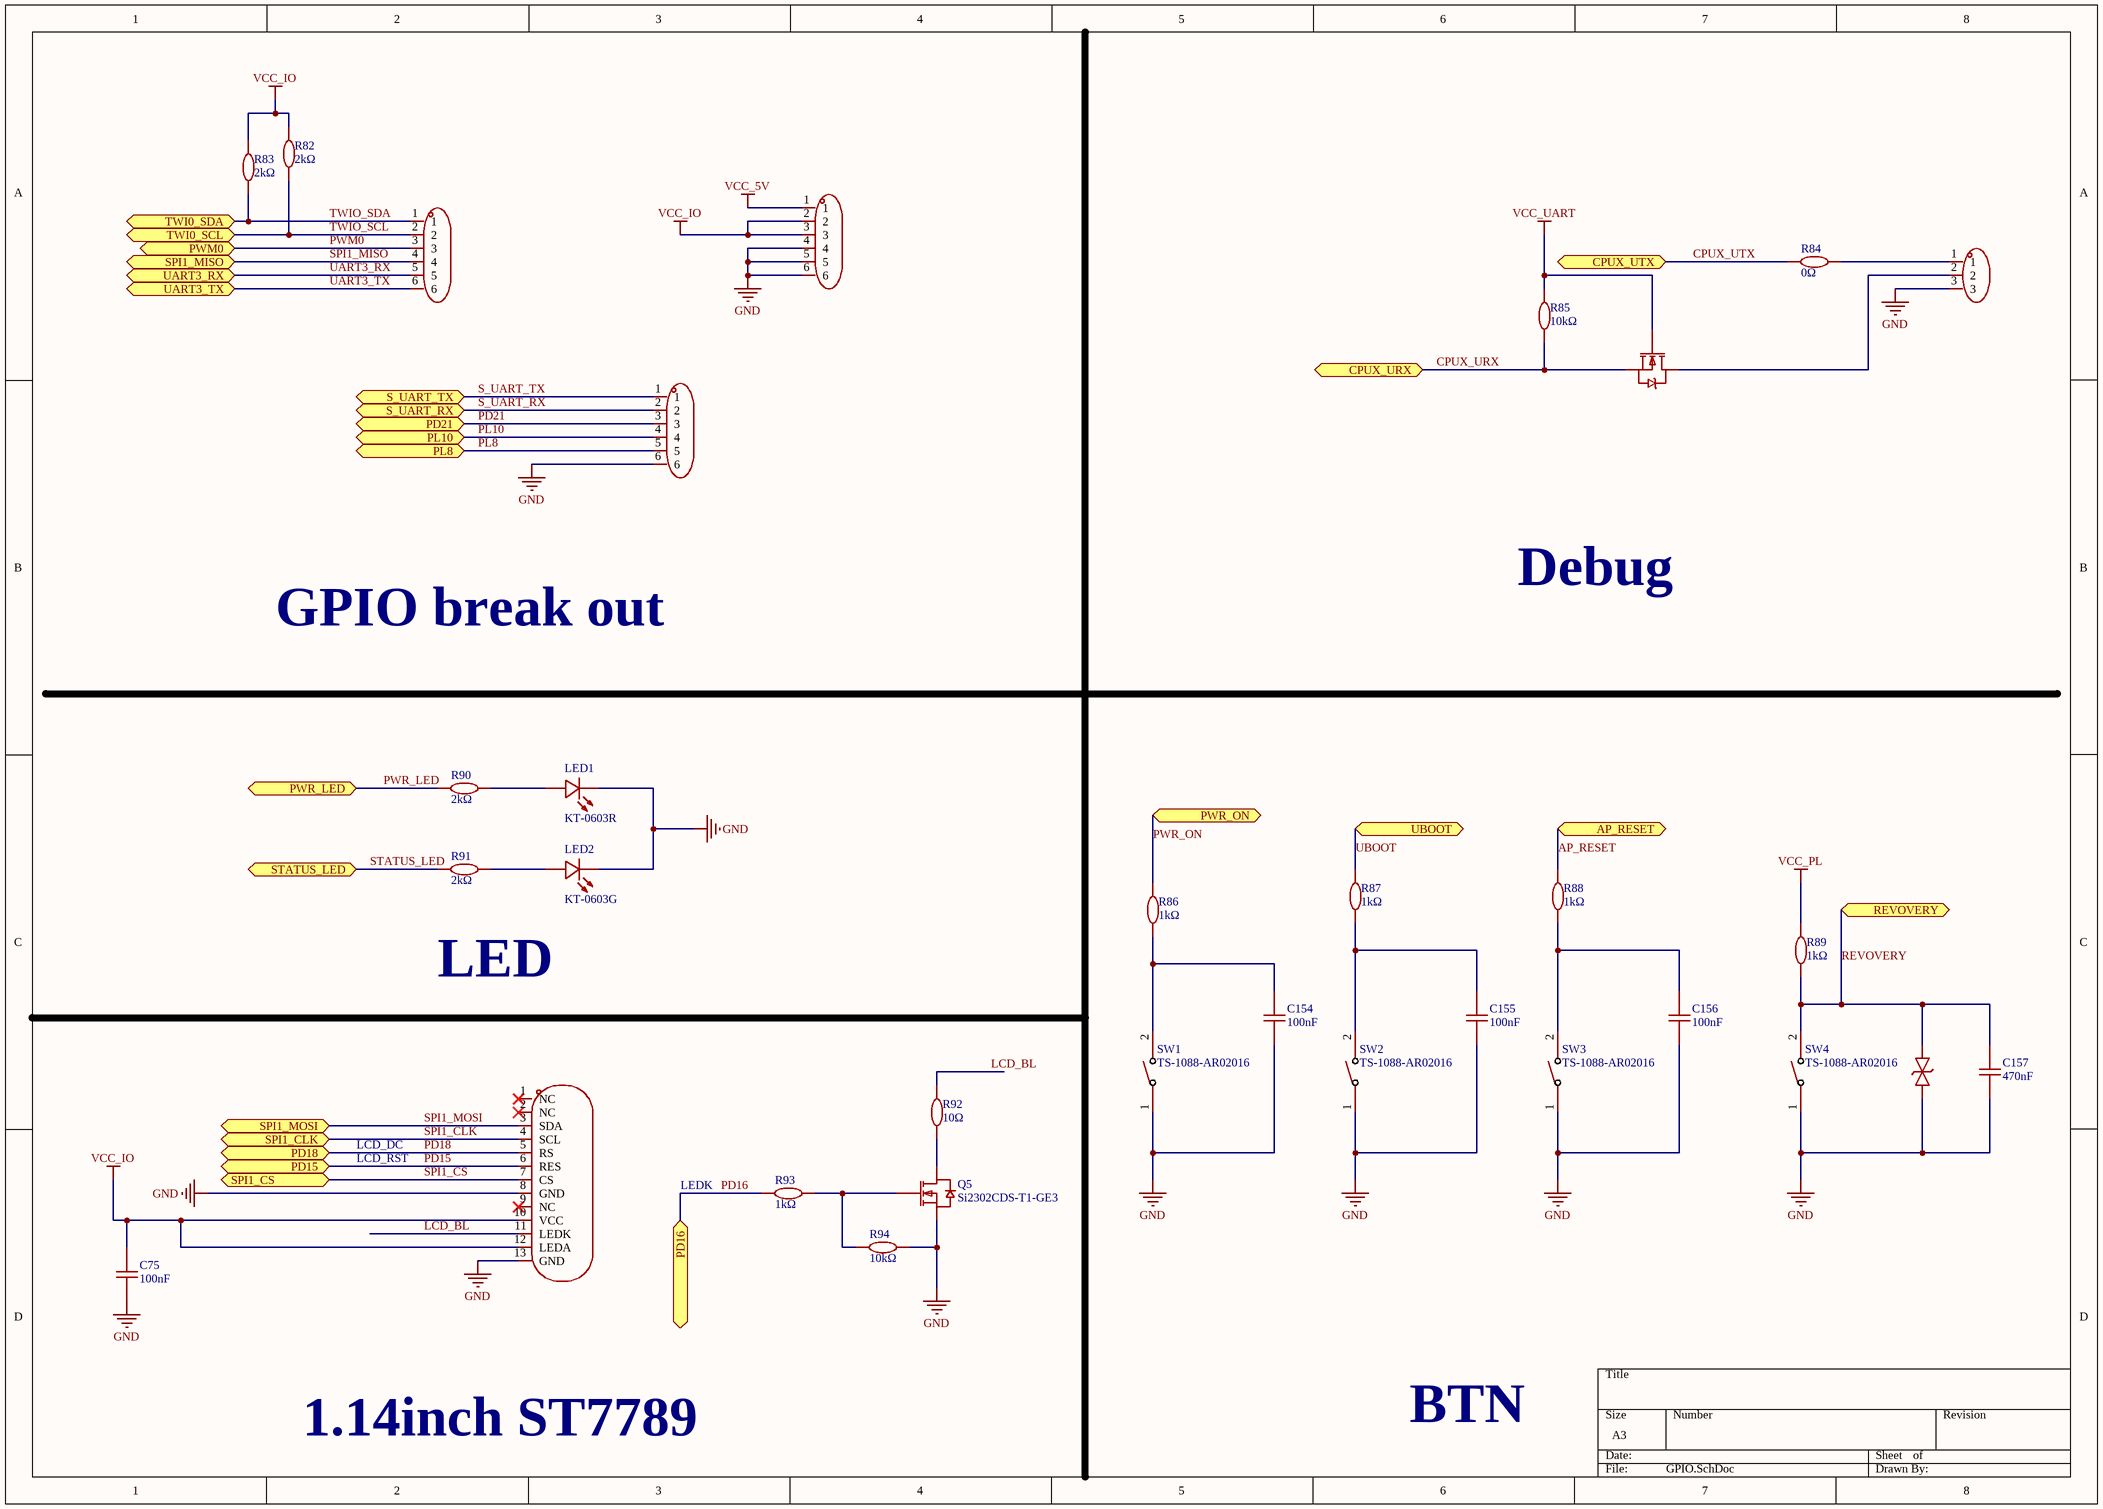
[diagram p7: GPIO.SchDoc]

### Parts
C75  100nF  [C0402]
C154  100nF  [C0402]
C155  100nF  [C0402]
C156  100nF  [C0402]
C157  470nF  [C0402]
H2  HX PZ2.54-1x3P ZZ  [CONN-TH_HX-PZ2.54-1X3P-ZZ]  (value not drawn)
LCD1  N099-0416THBIG01-H10  [LCD-SMD_10P-P0.70-L44.8-W8.6_N099-0416THBIG01-H10]  (value not drawn)
LED1  KT-0603R  [LED0603-RD]
LED2  KT-0603G  [LED0603-GR]
Q4  BSN20  [SOT-23-3_L2.9-W1.6-P1.90-LS2.8-BR]  (value not drawn)
Q5  Si2302CDS-T1-GE3  [SOT-23_L2.9-W1.3-P1.90-LS2.4-BR]
R82  2kΩ  [R0402]
R83  2kΩ  [R0402]
R84  0Ω  [R0402]
R85  10kΩ  [R0402]
R86  1kΩ  [R0402]
R87  1kΩ  [R0402]
R88  1kΩ  [R0402]
R89  1kΩ  [R0402]
R90  2kΩ  [R0402]
R91  2kΩ  [R0402]
R92  10Ω  [R0402]
R93  1kΩ  [R0402]
R94  10kΩ  [R0402]
SW1  TS-1088-AR02016  [SW-SMD_L3.9-W3.0-P4.45]
SW2  TS-1088-AR02016  [SW-SMD_L3.9-W3.0-P4.45]
SW3  TS-1088-AR02016  [SW-SMD_L3.9-W3.0-P4.45]
SW4  TS-1088-AR02016  [SW-SMD_L3.9-W3.0-P4.45]
U12  HX PZ2.54-1x6P ZZ  [HDR-TH_6P-P2.54-V-M]  (value not drawn)
U33  HX PZ2.54-1x6P ZZ  [HDR-TH_6P-P2.54-V-M]  (value not drawn)
U34  HX PZ2.54-1x6P ZZ  [HDR-TH_6P-P2.54-V-M]  (value not drawn)
U35  ESD5451N  [DFN1006-2L-BI]  (value not drawn)

### Ports
AP_RESET (bidir, see Power[4B], SoC_2[4A]), CPUX_URX (bidir, see SoC_1[6B]), CPUX_UTX (bidir, see SoC_1[6B]), PD15 (bidir, see SoC_1[2B]), PD16 (bidir, see SoC_1[2C]), PD18 (bidir, see SoC_1[2C]), PD21 (bidir, see SoC_1[2C]), PL8 (bidir, see SoC_1[6C]), PL10 (bidir, see SoC_1[6C]), PWM0 (bidir, see SoC_1[2C]), PWR_LED (bidir, see SoC_1[6C]), PWR_ON (bidir, see Power[4B]), REVOVERY (bidir, see SoC_1[6C]), S_UART_RX (bidir, see SoC_1[6C]), S_UART_TX (bidir, see SoC_1[6C]), SPI1_CLK (bidir, see SoC_1[6B]), SPI1_CS (bidir, see SoC_1[6B]), SPI1_MISO (bidir, see SoC_1[6B]), SPI1_MOSI (bidir, see SoC_1[6B]), STATUS_LED (bidir, see SoC_1[6C]), TWI0_SCL (bidir, see SoC_1[2C]), TWI0_SDA (bidir, see SoC_1[2C]), UART3_RX (bidir, see SoC_1[2C]), UART3_TX (bidir, see SoC_1[2C]), UBOOT (bidir, see SoC_2[4A])

### Nets
GND: C75.1 C154.1 C155.1 C156.1 C157.1 H2.3 LCD1.8(GND) LCD1.13(GND) LED1.1(K) LED2.1(K) Q5.2(S) R94.2 SW1.1 SW2.1 SW3.1 SW4.1 U12.4 U12.5 U12.6 U34.6 U35.1
VCC_5V: U12.1  [project net PS]
VCC_IO: C75.2 LCD1.10(VCC) LCD1.12(LEDA) Q4.1(G) R82.2 R83.2 R85.2 U12.2 U12.3  [also labelled VCC_UART]  [project net ALDO3]
VCC_PL: R89.2  [project net ALDO1]
AP_RESET: R88.2 ; port AP_RESET
CPUX_URX: Q4.2(S) R85.1 ; port CPUX_URX
CPUX_UTX: R84.1 ; port CPUX_UTX
LCD_BL: LCD1.11(LEDK) R92.2
PD15: LCD1.6(RES) ; port PD15
PD16: R93.2 ; port PD16
PD18: LCD1.5(RS) ; port PD18
PD21: U34.3 ; port PD21
PL8: U34.5 ; port PL8
PL10: U34.4 ; port PL10
PWM0: U33.3 ; port PWM0
PWR_LED: R90.1 ; port PWR_LED
PWR_ON: R86.2 ; port PWR_ON
REVOVERY: C157.2 R89.1 SW4.2 U35.2 ; port REVOVERY
S_UART_RX: U34.2 ; port S_UART_RX
S_UART_TX: U34.1 ; port S_UART_TX
SPI1_CLK: LCD1.4(SCL) ; port SPI1_CLK
SPI1_CS: LCD1.7(CS) ; port SPI1_CS
SPI1_MISO: U33.4 ; port SPI1_MISO
SPI1_MOSI: LCD1.3(SDA) ; port SPI1_MOSI
STATUS_LED: R91.1 ; port STATUS_LED
TWIO_SCL: R82.1 U33.2 ; port TWI0_SCL
TWIO_SDA: R83.1 U33.1 ; port TWI0_SDA
UART3_RX: U33.5 ; port UART3_RX
UART3_TX: U33.6 ; port UART3_TX
UBOOT: R87.2 ; port UBOOT
NetC154_2: C154.2 R86.1 SW1.2
NetC155_2: C155.2 R87.1 SW2.2
NetC156_2: C156.2 R88.1 SW3.2
NetH2_1: H2.1 R84.2
NetH2_2: H2.2 Q4.3(D)
NetLED1_2: LED1.2(A) R90.2
NetLED2_2: LED2.2(A) R91.2
NetQ5_1: Q5.1(G) R93.1 R94.1
NetQ5_3: Q5.3(D) R92.1

Not connected (* = marked no-connect by the designer): LCD1 1(NC)* 2(NC)* 9(NC)*

### Notes on the sheet
- GPIO break out
- Debug
- LED
- LCD_DC
- LCD_RST
- LEDK
- 1.14inch ST7789
- BTN

### Library data of the parts
C75 C154-C156 = 100nF: as C90 on sheet Wi-Fi
C157 = 470nF: 25V 470nF X5R ±10% 0402 Ceramic Capacitors ROHS
H2 = HX PZ2.54-1x3P ZZ: Manufacturer: hanxia(韩下); Add into BOM: yes; Pin Structure: 1x3P; Pitch: 2.54mm; Circluar Pins/Square Pins: Pin Header; Current Rating: 3A; Voltage Rating (Max): 1kV; Symbol: HX PZ2.54-1X3P ZZ; Device: HX PZ2.54-1x3P ZZ; LCSC Part Name: 1x3P 间距:2.54mm 方针 直插; Supplier Part: C32713269; Manufacturer Part: HX PZ2.54-1x3P ZZ; Supplier Footprint: 插件,P=2.54mm; JLCPCB Part Class: Extended Part; Datasheet: https://item.szlcsc.com/datasheet/HX%2520PZ2.54-1x3P%2520ZZ/34444549.html; Supplier: LCSC; Convert to PCB: yes; Row Spacing: -; Mounting Type: Through Hole; Number of Rows: 1; Number of Pins: 3P; Length of Mating Pin: 6mm; Insulation Height: 2.5mm; Length of End Connection Pin: 3mm; Contact Material: Brass; Contact Plating: Gold; Operating Temperature: -40℃~+105℃; Color: Black; Supplementary Features: -
LCD1 = N099-0416THBIG01-H10: 1.14inch ST7789 135x240 2 LCD, OLED, Graphic ROHS; Manufacturer: Wisevision(新智景); Add into BOM: yes; Dot Pixels: 160x40; Symbol: N099-0416THBIG01-H10; Device: N099-0416THBIG01-H10; LCSC Part Name: 0.99寸 彩色 40x160像素分辨率 焊接10PIN; Supplier Part: C5123574; Manufacturer Part: N099-0416THBIG01-H10; Supplier Footprint: -; JLCPCB Part Class: Extended Part; Datasheet: https://item.szlcsc.com/datasheet/N099-0416THBIG01-H10/5717767.html; Supplier: LCSC; Convert to PCB: yes; Size: 0.99
LED1 = KT-0603R: 25mA 1.8V~2.4V Red 0603 LED Indication - Discrete ROHS
LED2 = KT-0603G: Green 0603 LED Indication - Discrete ROHS
Q4 = BSN20_C116157: 50V 100mA 10Ω@2.75V,0.2A 1.5V@250uA 1 N-Channel SOT-23 Single FETs, MOSFETs ROHS; Manufacturer: SHIKUES(时科); Add into BOM: yes; Number: 1个N沟道; Input Capacitance(Ciss): 40pF; Reverse Transfer Capacitance (Crss@Vds): 10pF; Type: N沟道; Output Capacitance(Coss): 15pF; Symbol: BSN20; Device: BSN20_C116157; LCSC Part Name: 1个N沟道 耐压:50V 电流:0.1A; Supplier Part: C116157; Manufacturer Part: BSN20; Supplier Footprint: SOT-23; JLCPCB Part Class: Extended Part; Datasheet: https://item.szlcsc.com/datasheet/BSN20/117410.html; Supplier: LCSC; Convert to PCB: yes; Drain to Source Voltage: 50V; Current - Continuous Drain(Id): 100mA; RDS(on): 10Ω@2.75V,0.2A; Pd - Power Dissipation: -; Gate Threshold Voltage (Vgs(th)): 1.5V@250uA
R82 R83 R90 R91 = 2kΩ: as R77 on sheet SoC_2
R84 = 0Ω: as R23 on sheet Wi-Fi
R85 R94 = 10kΩ: as R18-R21 on sheet Wi-Fi
R86-R89 R93 = 1kΩ: as R66 on sheet Wi-Fi
R92 = 10Ω: 10Ω 62.5mW 50V ±200ppm/℃ Thick Film Resistor ±1% 0402 Chip Resistor - Surface Mount ROHS
SW1-SW4 = TS-1088-AR02016: Without Bracket 4mm 12V 3mm Round Button SPST 50mA SMD,4x3mm Tactile Switches ROHS
U12 U33 U34 = HX PZ2.54-1x6P ZZ: 6P 1x6P Gold Brass -40℃~+105℃ Black Pin Header 2.54mm 2.5mm 6mm 1kV 3mm 3A 1 Through Hole Through Hole,P=2.54mm Headers, Male Pins ROHS; Manufacturer: hanxia(韩下); Add into BOM: yes; Symbol: HX PZ2.54-1X6P ZZ; Device: HX PZ2.54-1x6P ZZ; LCSC Part Name: 1x6P 间距:2.54mm 方针 直插; Supplier Part: C32713272; Manufacturer Part: HX PZ2.54-1x6P ZZ; Supplier Footprint: 插件,P=2.54mm; JLCPCB Part Class: Extended Part; Datasheet: https://item.szlcsc.com/datasheet/HX%2520PZ2.54-1x6P%2520ZZ/34444552.html; Supplier: LCSC; Convert to PCB: yes; Pin Structure: 1x6P; Pitch: 2.54mm; Row Spacing: -; Circluar Pins/Square Pins: Pin Header; Mounting Type: Through Hole; Number of Rows: 1; Number of Pins: 6P; Current Rating: 3A; Voltage Rating (Max): 1kV; Length of Mating Pin: 6mm; Insulation Height: 2.5mm; Length of End Connection Pin: 3mm; Contact Material: Brass; Contact Plating: Gold; Operating Temperature: -40℃~+105℃; Color: Black; Supplementary Features: -
U35 = ESD5451N_C5261080: as U32 on sheet SoC_2; Symbol: ESD5451N_C5261080; Device: ESD5451N_C5261080; LCSC Part Name: 5V 15pF 双向; Supplier Part: C5261080; Manufacturer Part: ESD5451N; Supplier Footprint: DFN1006-2L; JLCPCB Part Class: Extended Part; Datasheet: https://item.szlcsc.com/datasheet/ESD5451N/5983779.html; Supplier: LCSC; Convert to PCB: yes; Polarity: Bidirectional; Reverse Stand-Off Voltage (Vrwm): 5V; Clamping Voltage: 9.8V; Peak Pulse Current (Ipp): 9A; Voltage - Breakdown: 8V; Type: ESD

## Nets that join several sheets
ALDO1: SoC_1 (C99.2 U2.H18), Power (5 pins), GPIO (R89.2)
ALDO2: Power (C66.2 U4.31), SoC_2 (10 pins)
ALDO3: SoC_1 (R70.1 U2.R6), eMMC (6 pins), Power (5 pins), SoC_2 (5 pins), GPIO (9 pins)
BLDO1: LPDDR3 (C18.2 U2.W22), Power (C72.2 U4.2), SoC_2 (6 pins)
BLDO2: Power (C73.2 R49.1 U4.1), SoC_2 (5 pins)
GND: LPDDR3 (93 pins), SoC_1 (5 pins), eMMC (18 pins), Power (49 pins), Wi-Fi (29 pins), SoC_2 (209 pins), GPIO (21 pins)
PS: Power (27 pins), Wi-Fi (C90.2 C91.2 U30.4), GPIO (U12.1)
VCC18_RTC: Power (5 pins), SoC_2 (C149.2 R75.1 U2.F20)
VCC33_WIFI: Power (R51.1), Wi-Fi (6 pins)
VCC_DCXOIO: SoC_1 (C98.2 C100.2 U2.H6 U2.M19), Power (R47.1 R50.1), Wi-Fi (13 pins), SoC_2 (C126.2 U2.A22)
VCC_DRAM: LPDDR3 (77 pins), Power (C76.2 L6.2 U4.10)
VCC_PC: SoC_1 (C97.2 U2.N19), eMMC (8 pins), Power (R48.1 R49.2)
VDD09_HDMI: Power (C69.2 L5.2 U4.9), SoC_2 (19 pins)
VDD18_LPDDR: LPDDR3 (12 pins), Power (R39.2)
VDD_CPU: Power (C56.2 C61.2 L2.2 L3.2), SoC_2 (15 pins)
VDD_GPU: Power (C63.2 L4.2), SoC_2 (13 pins)
AP_CK32KO: Wi-Fi (R29.2 R30.2), SoC_2 (U2.G20)
AP_NMI: Power (R43.2 U4.16), SoC_2 (C102.2 U2.G21)
AP_RESET: Power (C57.2 U4.15), SoC_2 (C103.2 R75.2 U2.G22 U32.2), GPIO (R88.2)
AP_WAKE_BT: SoC_1 (U2.L22), Wi-Fi (R31.2 U6.6)
BT_PCM_CLK: SoC_1 (U2.K2), Wi-Fi (U6.26)
BT_PCM_DIN: SoC_1 (U2.L3), Wi-Fi (U6.27)
BT_PCM_DOUT: SoC_1 (U2.L4), Wi-Fi (U6.25)
BT_PCM_SYNC: SoC_1 (U2.K3), Wi-Fi (U6.28)
BT_REG_ON: SoC_1 (U2.L19), Wi-Fi (R23.2 R32.2)
BT_UART_CTS: SoC_1 (U2.H3), Wi-Fi (R18.1 U6.44)
BT_UART_RTS: SoC_1 (U2.K1), Wi-Fi (R21.1 U6.41)
BT_UART_RX: SoC_1 (U2.H4), Wi-Fi (R19.1 U6.43)
BT_UART_TX: SoC_1 (U2.J6), Wi-Fi (R20.1 U6.42)
BT_WAKE_AP: SoC_1 (U2.L21), Wi-Fi (U6.7)
CPUX_URX: SoC_1 (U2.D12), GPIO (Q4.2 R85.1)
CPUX_UTX: SoC_1 (U2.C9), GPIO (R84.1)
EMMC_CLK: SoC_1 (C43.2 R34.1), eMMC (U3.M6)
EMMC_CMD: SoC_1 (U2.M21), eMMC (R37.1 U3.M5)
EMMC_D0: SoC_1 (U2.N22), eMMC (U3.A3)
EMMC_D1: SoC_1 (U2.N23), eMMC (U3.A4)
EMMC_D2: SoC_1 (U2.R22), eMMC (U3.A5)
EMMC_D3: SoC_1 (U2.R23), eMMC (U3.B2)
EMMC_D4: SoC_1 (U2.T22), eMMC (U3.B3 U3.C3)
EMMC_D5: SoC_1 (U2.T21), eMMC (U3.B4)
EMMC_D6: SoC_1 (U2.U19), eMMC (U3.B5 U3.C5)
EMMC_D7: SoC_1 (U2.U21), eMMC (U3.B6)
EMMC_DS: SoC_1 (U2.R20), eMMC (R38.2 U3.H5)
EMMC_RST: SoC_1 (R36.1), eMMC (U3.K5)
PD15: SoC_1 (U2.R3), GPIO (LCD1.6)
PD16: SoC_1 (U2.R2), GPIO (R93.2)
PD18: SoC_1 (U2.P4), GPIO (LCD1.5)
PD21: SoC_1 (U2.T3), GPIO (U34.3)
PL8: SoC_1 (U2.H22), GPIO (U34.5)
PL10: SoC_1 (U2.H21), GPIO (U34.4)
PMU_SCK: SoC_1 (U2.K20), Power (R45.1 U4.23)
PMU_SDA: SoC_1 (U2.K23), Power (R44.1 U4.24)
PWM0: SoC_1 (U2.U2), GPIO (U33.3)
PWR_LED: SoC_1 (U2.K21), GPIO (R90.1)
PWR_ON: Power (U4.27), GPIO (R86.2)
REVOVERY: SoC_1 (U2.J22), GPIO (C157.2 R89.1 SW4.2 U35.2)
S_UART_RX: SoC_1 (U2.J20), GPIO (U34.2)
S_UART_TX: SoC_1 (U2.K22), GPIO (U34.1)
SPI1_CLK: SoC_1 (U2.E12), GPIO (LCD1.4)
SPI1_CS: SoC_1 (U2.D11), GPIO (LCD1.7)
SPI1_MISO: SoC_1 (U2.D9), GPIO (U33.4)
SPI1_MOSI: SoC_1 (U2.F9), GPIO (LCD1.3)
STATUS_LED: SoC_1 (U2.J21), GPIO (R91.1)
TWIO_SCL: SoC_1 (U2.U3), GPIO (R82.1 U33.2)
TWIO_SDA: SoC_1 (U2.R5), GPIO (R83.1 U33.1)
UART3_RX: SoC_1 (U2.V1), GPIO (U33.5)
UART3_TX: SoC_1 (U2.U5), GPIO (U33.6)
UBOOT: SoC_2 (U2.G17), GPIO (R87.2)
VDD_CPUFB: Power (U4.39 U4.40), SoC_2 (U2.R16 U2.T17)
VDD_GPUFB: Power (U4.47), SoC_2 (U2.R7)
WIFI_PWR_EN: SoC_1 (U2.F8), Wi-Fi (R66.1)
WL_REG_ON: SoC_1 (U2.M22), Wi-Fi (R22.2 U6.12)
WL_SDIO_CLK: SoC_1 (R35.2), Wi-Fi (U6.17)
WL_SDIO_CMD: SoC_1 (U2.J3), Wi-Fi (R26.2 U6.16)
WL_SDIO_D0: SoC_1 (U2.J5), Wi-Fi (R25.2 U6.18)
WL_SDIO_D1: SoC_1 (U2.H2), Wi-Fi (R24.2 U6.19)
WL_SDIO_D2: SoC_1 (U2.L5), Wi-Fi (R28.2 U6.14)
WL_SDIO_D3: SoC_1 (U2.H5), Wi-Fi (R27.2 U6.15)
WL_WAKE_AP: SoC_1 (U2.L20), Wi-Fi (U6.13)